# EAGLE design diff2se (EAGLE 6.3)
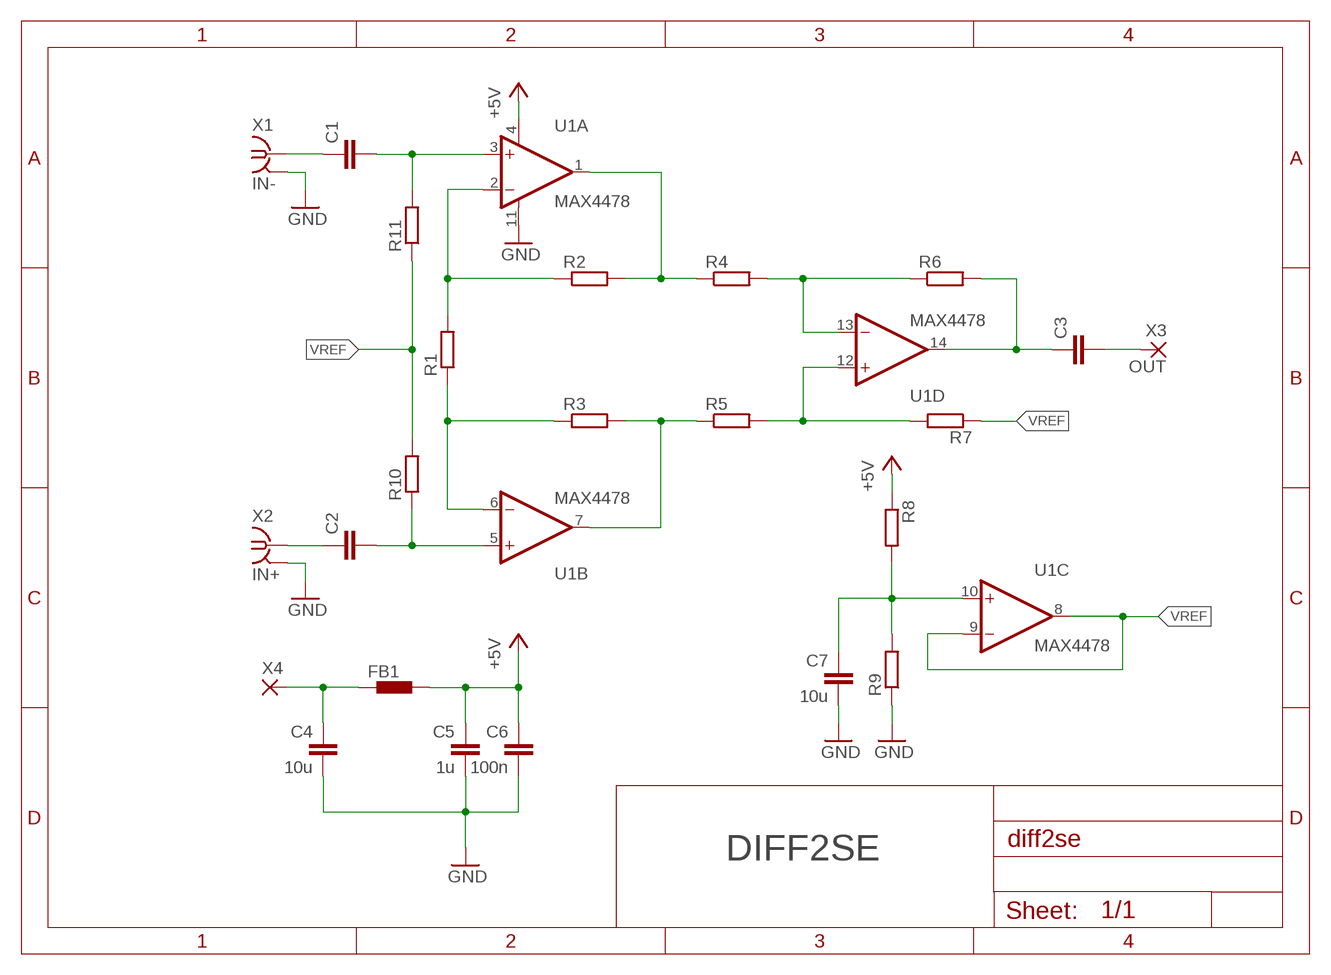
[diagram p0: schematic, sheet 1]

## Parts
C1  C-EUC0805K  [C0805K]
C2  C-EUC0805K  [C0805K]
C3  C-EUC0805K  [C0805K]
C4  10u  C-EUC0805K  [C0805K]
C5  1u  C-EUC0805K  [C0805K]
C6  100n  C-EUC0805K  [C0805K]
C7  10u  C-EUC0402  [C0402]
FB1  BML15H  [R0603]
R1  R-EU_WSC01/2  [WSC01/2]
R2  R-EU_R0805  [R0805]
R3  R-EU_R0805  [R0805]
R4  R-EU_R0805  [R0805]
R5  R-EU_R0805  [R0805]
R6  R-EU_R0805  [R0805]
R7  R-EU_R0805  [R0805]
R8  R-EU_R0402  [R0402]
R9  R-EU_R0402  [R0402]
R10  R-EU_R0402  [R0402]
R11  R-EU_R0402  [R0402]
U1  MAX4478  OPA4130U  [SO14]
X1  IN-  SMA-142-0701-881/886  [J502-ND-142-0701-881/886]
X2  IN+  SMA-142-0701-881/886  [J502-ND-142-0701-881/886]
X3  OUT  SMD2  [SMD1,27-2,54]
X4  SMD2  [SMD1,27-2,54]

## Nets
+5V: C5.1 C6.1 FB1.2 R8.1 U1.4(A:V+)
GND: C4.2 C5.2 C6.2 C7.2 R9.1 U1.11(A:V-) X1.G@1(GND) X2.G@1(GND)
N$1: R1.2 R2.1 U1.2(A:-IN)
N$2: R1.1 R3.1 U1.6(B:-IN)
N$3: R3.2 R5.1 U1.7(B:OUT)
N$4: R2.2 R4.1 U1.1(A:OUT)
N$5: C1.1 X1.1
N$6: C1.2 R11.2 U1.3(A:+IN)
N$7: C2.1 X2.1
N$8: C2.2 R10.1 U1.5(B:+IN)
N$9: R4.2 R6.1 U1.13(D:-IN)
N$10: R5.2 R7.2 U1.12(D:+IN)
N$11: C3.1 R6.2 U1.14(D:OUT)
N$12: C3.2 X3.1(P)
N$13: C4.1 FB1.1 X4.1(P)
N$14: C7.1 R8.2 R9.2 U1.10(C:+IN)
VREF: R7.1 R10.2 R11.1 U1.8(C:OUT) U1.9(C:-IN)

## Notes on the sheet
- DIFF2SE

## Power pins joined to a net without a drawn wire
GND: X1.G@2(GND) X1.G@3(GND) X1.G@4(GND) X2.G@2(GND) X2.G@3(GND) X2.G@4(GND)

## Library data of the parts
C1-C7 = rcl:C-EU: CAPACITOR, European symbol
FB1 = ferrite-bead:BML15H: EMIFIL (R) Chip Ferrite Bead for GHz Noise Source: http://www.murata.com/ Ferrite Bead BLM15H.pdf
R1-R11 = rcl:R-EU_: RESISTOR, European symbol
U1 = burr-brown:OPA4130: Low Power, Precision FET-Input Operational Amplifiers; MF: TEXAS INSTRUMENTS; MPN: OPA4130UA; OC_FARNELL: 1648707; OC_NEWARK: 80K8080
X1 X2 = con-coax:SMA-: SMA 50 Ohm End Launch Jack Receptacle - Round Contact Johnson Components Source: www.johnsoncomponents.com .. J502-ND.pdf; MF: JOHNSON COMPONENTS; MPN: 142-0701-881; OC_FARNELL: 1608603; OC_NEWARK: 08B906
X3 X4 = wirepad:SMD2: SMD PAD

## Board
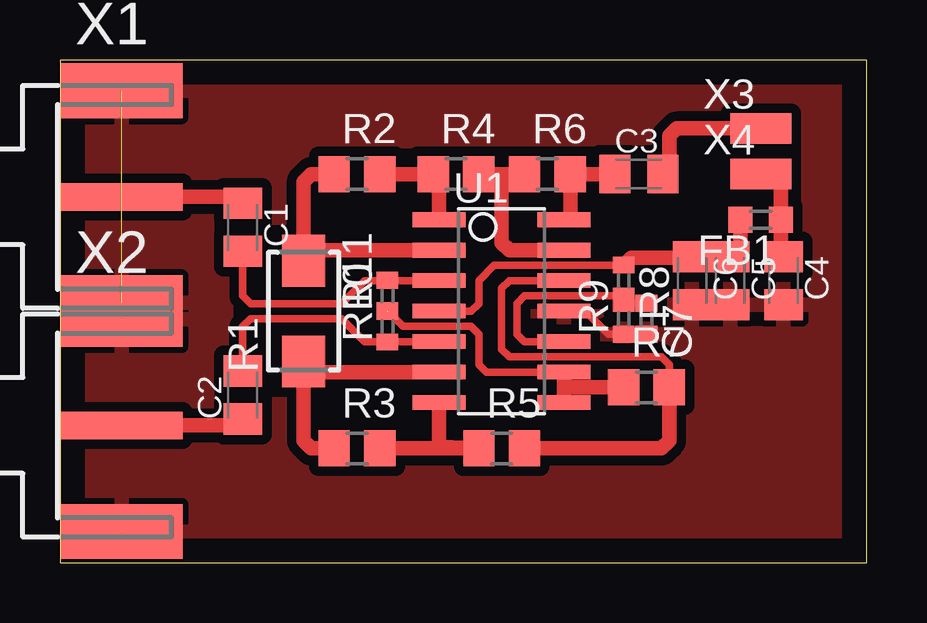
[diagram p1: board, top side]
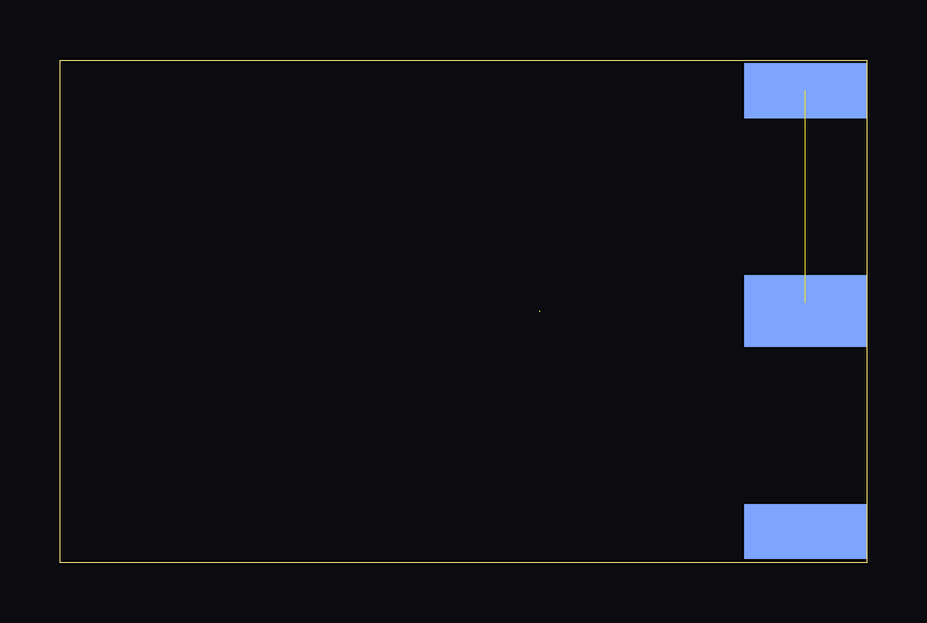
[diagram p2: board, bottom side, seen from below]

Size 33.63 x 20.94 mm. Coordinates in mm from the lower left corner, seen from the top.
Outline: 0,0 33.63,0 33.63,20.94 0,20.94 0,0
Copper layers (1*16): Top 0.035mm / dielectric 1.5mm / Bottom 0.035mm
Design rules "default *": minimum track width 10mil, minimum drill 24mil, track to track 8mil, track to pad 8mil, pad to pad 8mil, via to via 8mil, smd to smd 8mil, copper to edge 40mil, drill to drill 8mil, minimum pad ring 10mil, minimum via ring 8mil, stop-mask expansion 4mil, vias tented up to drill 0mil, thermal gap 10mil

### Footprints (pad centres in the part's own frame; a part is rotated, then mirrored left to right if it is on the bottom)
C0805K = smd 1.3 x 1.6: 1 -1,0; 2 1,0
C0402 = smd 0.7 x 0.9: 1 -0.65,0; 2 0.65,0
R0603 = smd 1 x 1.1: 1 -0.85,0; 2 0.85,0
WSC01/2 = smd 2.16 x 1.78: 1 -2.1,0; 2 2.1,0
R0805 = smd 1.3 x 1.5: 1 -0.95,0; 2 0.95,0
R0402 = smd 0.7 x 0.9: 1 -0.65,0; 2 0.65,0
SO14 = smd 0.61 x 2.21: 1 -3.81,-2.603; 2 -2.54,-2.603; 3 -1.27,-2.603; 4 0,-2.603; 5 1.27,-2.603; 6 2.54,-2.603; 7 3.81,-2.603; 8 3.81,2.603; 9 2.54,2.603; 10 1.27,2.603; 11 0,2.603; 12 -1.27,2.603; 13 -2.54,2.603; 14 -3.81,2.603
J502-ND-142-0701-881/886 = smd 5.08 x 1.143: 1 2.565,0 | smd 5.08 x 2.286: G@1 2.565,4.42; G@2 2.565,-4.42 | smd 5.08 x 2.286 bottom: G@3 2.565,4.42; G@4 2.565,-4.42
SMD1,27-2,54 = smd 1.27 x 2.54: 1 0,0

### Placement (x,y rotation side)
C1  7.62,13.97 270 top
C2  7.62,6.98 90 top
C3  24.13,16.19 0 top
C4  30.16,11.75 270 top
C5  27.94,11.75 270 top
C6  26.35,11.75 270 top
C7  24.45,10.16 270 top
FB1  29.21,14.29 180 top
R1  10.16,10.48 90 top
R2  12.38,16.19 0 top
R3  12.38,4.76 0 top
R4  16.51,16.19 0 top
R5  18.41,4.76 0 top
R6  20.32,16.19 0 top
R7  24.45,7.3 0 top
R8  23.5,11.75 270 top
R9  23.5,10.16 90 top
R10  13.65,9.84 90 top
R11  13.65,11.11 90 top
U1  18.41,10.48 270 top
X1  0,15.24 0 top
X2  0,5.71 0 top
X3  29.21,18.1 270 top
X4  29.21,16.19 270 top

### Tracks (layer width: path | path; a pad name or v marks a point on that pad's centre or on a via)
+5V
  Top 0.305: U1.4 17.14,10.48 17.46,10.79 17.46,11.75 18.1,12.38 22.96,12.38 R8.1
  Top 0.61: R8.1 23.81,12.7 26.3,12.7 C6.1 C5.1 28.36,13.17 FB1.2
GND  (5 unrouted)
  Top 0.305: U1.11 21.91,10.48 22.86,9.52 23.5,9.52 | 23.5,9.52 24.43,9.52 C7.2 24.45,9.52 | R9.1 23.5,9.52
  pour Top (isolate 0.406): 0,20.96 33.66,20.96 33.66,0 0,0
N$1
  Top 0.61: R2.1 10.48,16.19 10.16,15.87 R1.2 10.6,13.02 U1.2
N$2
  Top 0.61: R3.1 10.48,4.76 10.16,5.08 R1.1 10.6,7.94 U1.6
N$3
  Top 0.61: R3.2 R5.1 15.81,4.82 U1.7
N$4
  Top 0.61: U1.1 15.81,16.04 R4.1 R2.2
N$5
  Top 0.61: X1.1 7.62,15.24 C1.1
N$6
  Top 0.305: C1.2 7.62,11.11 7.94,10.79 11.75,10.79 12.7,11.75 13.65,11.75 U1.3
  Top 0.61: R11.2 13.65,11.75
N$7
  Top 0.61: X2.1 7.62,5.71 C2.1
N$8
  Top 0.305: C2.2 7.62,9.84 7.94,10.16 11.75,10.16 12.7,9.21 13.65,9.21 U1.5
  Top 0.61: R10.1 13.65,9.21
N$9
  Top 0.61: R4.2 18.41,16.19 | 18.41,16.19 R6.1 | U1.13 18.73,13.02 18.41,13.33 18.41,16.19
N$10
  Top 0.305: U1.12 18.73,11.75 18.41,11.43 18.41,8.89 18.73,8.57 25.08,8.57 25.4,8.25 R7.2
  Top 0.61: R5.2 25.08,4.76 25.4,5.08 R7.2
N$11
  Top 0.61: U1.14 21.27,14.29 R6.2 C3.1
N$12
  Top 0.61: X3.1 25.72,18.1 25.4,17.78 25.4,16.46 C3.2
N$13
  Top 0.61: C4.1 30.06,12.85 FB1.1 30.06,15.98 30.16,16.19 X4.1
N$14
  Top 0.305: U1.10 19.37,9.21 19.05,9.52 19.05,10.79 19.37,11.11 23.5,11.11 R8.2 R9.2 C7.1
VREF  (1 unrouted)
  Top 0.305: U1.9 17.78,7.94 17.46,8.25 17.46,9.52 17.14,9.84 14.3,9.84 R10.2
  Top 0.61: U1.8 21.02,7.3 | 21.02,7.3 U1.9 | R7.1 21.02,7.3